# Altium schematic sheet P14 Hi3531AV100(SATA&PC.SchDoc
size 420 x 297 mm
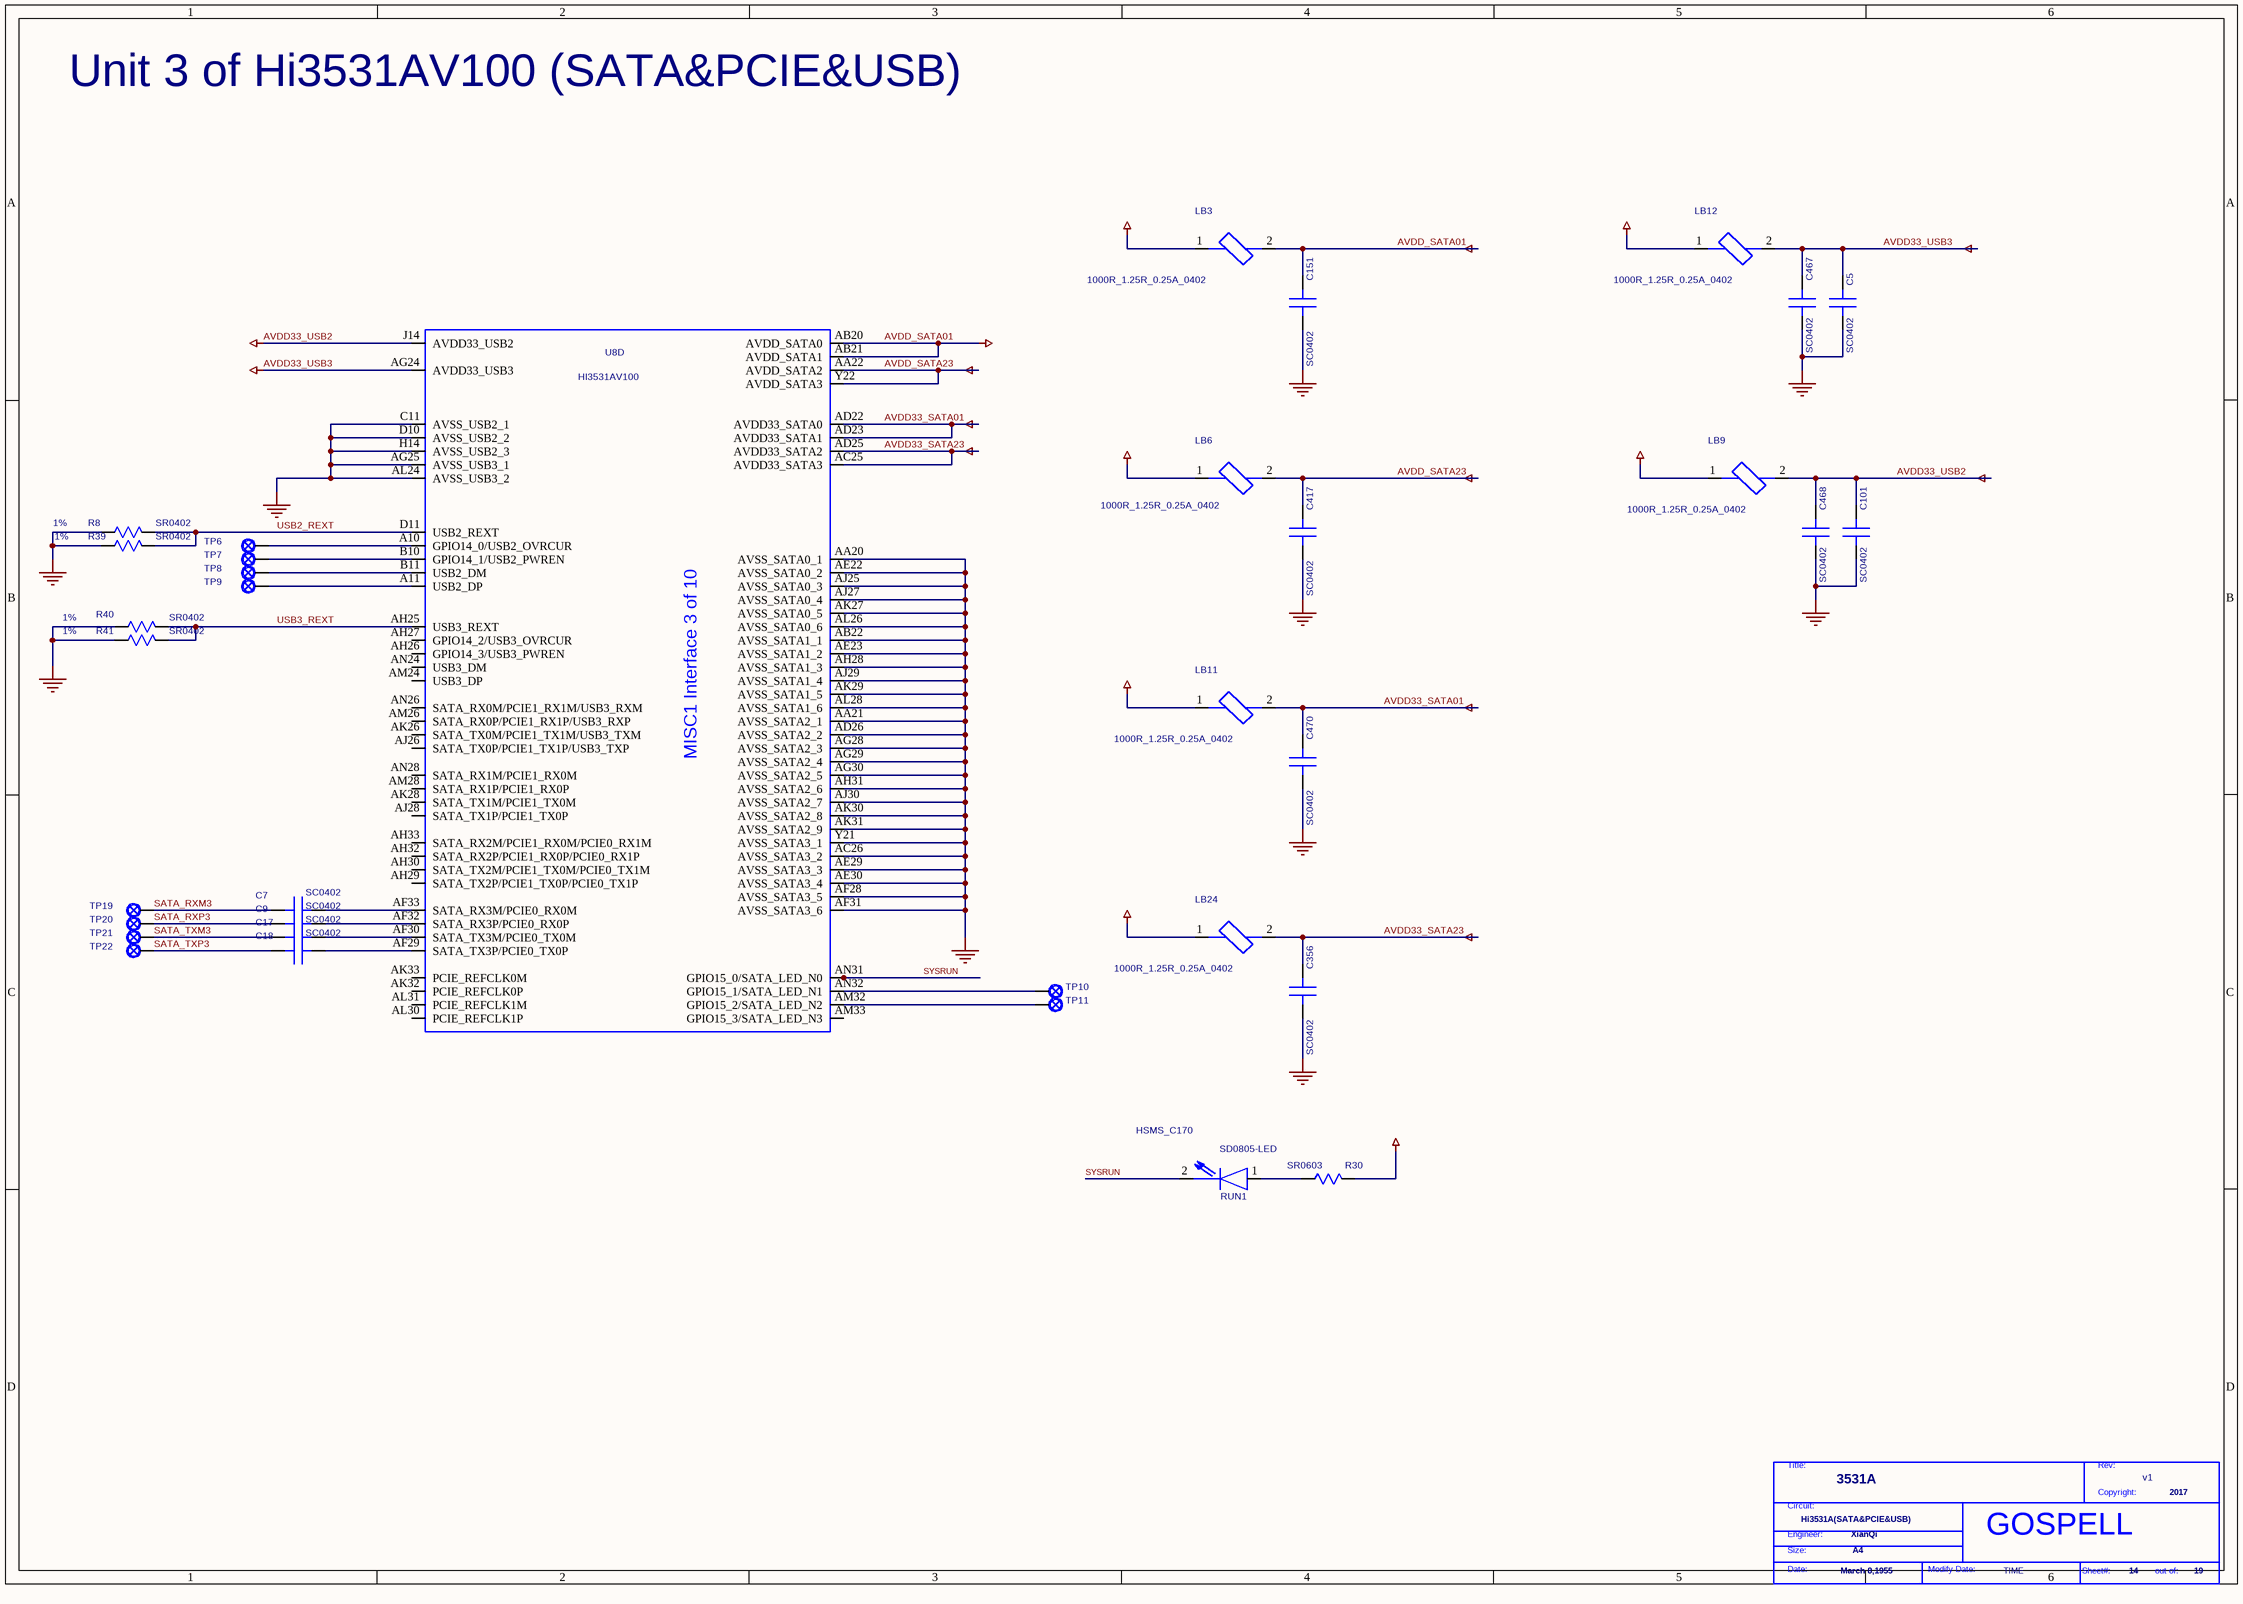
[diagram p0: P14 Hi3531AV100(SATA&PC.SchDoc]

## Parts
*  Page Modify Date: TIME  Engineer: XianQi  Copyright: 2017  Title: 3531A  RevCode: v1  Page Size: A4  Page Create Date: March 8,1955  Page Number: 14  Page Count: 19  Doc: Hi3531A(SATA&PCIE&USB)  (hidden comment: GOSPELL)  (graphical)
C5  SC0402  [SC0402]
C7  SC0402  [SC0402]
C9  SC0402  [SC0402]
C17  SC0402  [SC0402]
C18  SC0402  [SC0402]
C101  SC0402  [SC0402]
C151  SC0402  [SC0402]
C356  SC0402  [SC0402]
C417  SC0402  [SC0402]
C467  SC0402  [SC0402]
C468  SC0402  [SC0402]
C470  SC0402  [SC0402]
LB3  SL0402  [SL0402]  (value not drawn)
LB6  SL0402  [SL0402]  (value not drawn)
LB9  SL0402  [SL0402]  (value not drawn)
LB11  SL0402  [SL0402]  (value not drawn)
LB12  SL0402  [SL0402]  (value not drawn)
LB24  SL0402  [SL0402]  (value not drawn)
R8  SR0402  [SR0402]
R30  SR0603  [SR0603]
R39  SR0402  [SR0402]
R40  SR0402  [SR0402]
R41  SR0402  [SR0402]
RUN1  SD0805-LED  DEVICE: HSMS_C170  [SD0805-LED]
TP6  TP24-SMD  [TP24-SMD]  (value not drawn)
TP7  TP24-SMD  [TP24-SMD]  (value not drawn)
TP8  TP24-SMD  [TP24-SMD]  (value not drawn)
TP9  TP24-SMD  [TP24-SMD]  (value not drawn)
TP10  TP24-SMD  [TP24-SMD]  (value not drawn)
TP11  TP24-SMD  [TP24-SMD]  (value not drawn)
TP19  TP24-SMD  [TP24-SMD]  (value not drawn)
TP20  TP24-SMD  [TP24-SMD]  (value not drawn)
TP21  TP24-SMD  [TP24-SMD]  (value not drawn)
TP22  TP24-SMD  [TP24-SMD]  (value not drawn)
U8  DEVICE: HI3531AV100  [BGA805-32-3333]  (hidden comment: BGA805-32-3333)  (part D of 10)

## Nets
3V3: LB9.1 LB11.1 LB12.1 LB24.1 R30.1(A)
AVDD33_SATA01: C470.1(A) LB11.2 U8.AD22(AVDD33_SATA0) U8.AD23(AVDD33_SATA1)
AVDD33_SATA23: C356.1(A) LB24.2 U8.AC25(AVDD33_SATA3) U8.AD25(AVDD33_SATA2)
AVDD33_USB2: C101.1(A) C468.1(A) LB9.2 U8.J14(AVDD33_USB2)
AVDD33_USB3: C5.1(A) C467.1(A) LB12.2 U8.AG24(AVDD33_USB3)
AVDD_SATA01: C151.1(A) LB3.2 U8.AB20(AVDD_SATA0) U8.AB21(AVDD_SATA1)
AVDD_SATA23: C417.1(A) LB6.2 U8.AA22(AVDD_SATA2) U8.Y22(AVDD_SATA3)
DVDD_CORE: LB3.1 LB6.1
GND: C5.2(B) C101.2(B) C151.2(B) C356.2(B) C417.2(B) C467.2(B) C468.2(B) C470.2(B) R8.1(A) R39.1(A) R40.1(A) R41.1(A) U8.AA20(AVSS_SATA0_1) U8.AA21(AVSS_SATA2_1) U8.AB22(AVSS_SATA1_1) U8.AC26(AVSS_SATA3_2) U8.AD26(AVSS_SATA2_2) U8.AE22(AVSS_SATA0_2) U8.AE23(AVSS_SATA1_2) U8.AE29(AVSS_SATA3_3) U8.AE30(AVSS_SATA3_4) U8.AF28(AVSS_SATA3_5) U8.AF31(AVSS_SATA3_6) U8.AG25(AVSS_USB3_1) U8.AG28(AVSS_SATA2_3) U8.AG29(AVSS_SATA2_4) U8.AG30(AVSS_SATA2_5) U8.AH28(AVSS_SATA1_3) U8.AH31(AVSS_SATA2_6) U8.AJ25(AVSS_SATA0_3) U8.AJ27(AVSS_SATA0_4) U8.AJ29(AVSS_SATA1_4) U8.AJ30(AVSS_SATA2_7) U8.AK27(AVSS_SATA0_5) U8.AK29(AVSS_SATA1_5) U8.AK30(AVSS_SATA2_8) U8.AK31(AVSS_SATA2_9) U8.AL24(AVSS_USB3_2) U8.AL26(AVSS_SATA0_6) U8.AL28(AVSS_SATA1_6) U8.C11(AVSS_USB2_1) U8.D10(AVSS_USB2_2) U8.H14(AVSS_USB2_3) U8.Y21(AVSS_SATA3_1)
SATA_RXM3: C7.1(A) TP19.1
SATA_RXP3: C9.1(A) TP20.1
SATA_TXM3: C17.1(A) TP21.1
SATA_TXP3: C18.1(A) TP22.1
SYSRUN: RUN1.2(B) U8.AN31(GPIO15_0/SATA_LED_N0)
USB2_REXT: R8.2(B) R39.2(B) U8.D11(USB2_REXT)
USB3_REXT: R40.2(B) R41.2(B) U8.AH25(USB3_REXT)
NetC7_2: C7.2(B) U8.AF33(SATA_RX3M/PCIE0_RX0M)
NetC9_2: C9.2(B) U8.AF32(SATA_RX3P/PCIE0_RX0P)
NetC17_2: C17.2(B) U8.AF30(SATA_TX3M/PCIE0_TX0M)
NetC18_2: C18.2(B) U8.AF29(SATA_TX3P/PCIE0_TX0P)
NetR30_2: R30.2(B) RUN1.1(A)
NetTP6_1: TP6.1 U8.A10(GPIO14_0/USB2_OVRCUR)
NetTP7_1: TP7.1 U8.B10(GPIO14_1/USB2_PWREN)
NetTP8_1: TP8.1 U8.B11(USB2_DM)
NetTP9_1: TP9.1 U8.A11(USB2_DP)
NetTP10_1: TP10.1 U8.AN32(GPIO15_1/SATA_LED_N1)
NetTP11_1: TP11.1 U8.AM32(GPIO15_2/SATA_LED_N2)

Not connected (* = marked no-connect by the designer): U8 AH26(GPIO14_3/USB3_PWREN) AH27(GPIO14_2/USB3_OVRCUR) AH29(SATA_TX2P/PCIE1_TX0P/PCIE0_TX1P) AH30(SATA_TX2M/PCIE1_TX0M/PCIE0_TX1M) AH32(SATA_RX2P/PCIE1_RX0P/PCIE0_RX1P) AH33(SATA_RX2M/PCIE1_RX0M/PCIE0_RX1M) AJ26(SATA_TX0P/PCIE1_TX1P/USB3_TXP) AJ28(SATA_TX1P/PCIE1_TX0P) AK26(SATA_TX0M/PCIE1_TX1M/USB3_TXM) AK28(SATA_TX1M/PCIE1_TX0M) AK32(PCIE_REFCLK0P) AK33(PCIE_REFCLK0M) AL30(PCIE_REFCLK1P) AL31(PCIE_REFCLK1M) AM24(USB3_DP) AM26(SATA_RX0P/PCIE1_RX1P/USB3_RXP) AM28(SATA_RX1P/PCIE1_RX0P) AM33(GPIO15_3/SATA_LED_N3) AN24(USB3_DM) AN26(SATA_RX0M/PCIE1_RX1M/USB3_RXM) AN28(SATA_RX1M/PCIE1_RX0M)

## Notes on the sheet
- Unit 3 of Hi3531AV100 (SATA&PCIE&USB)
- (near LB3) 1000R_1.25R_0.25A_0402
- (near LB12) 1000R_1.25R_0.25A_0402
- 1%
- (near LB6) 1000R_1.25R_0.25A_0402
- (near LB9) 1000R_1.25R_0.25A_0402
- (near LB11) 1000R_1.25R_0.25A_0402
- (near LB24) 1000R_1.25R_0.25A_0402
- (in symbol GOSPELL) Title:; Rev:; Copyright:; Circuit:; Engineer:; Size:; Date:; Modify Date:; Sheet#:; out of:
- (in symbol HI3531AV100_M2_17, part D) MISC1 Interface 3 of 10

## Library data of the parts
C5 C7 C9 C17 C18 C101 = C_0_Dup2: PARTS: 1; PINSWAP: (A,B); LEVEL: STD; DEVICE: RMEMK105BJ104KV_FR; OriginalSymbolOrigin: (0,30); CODE: 8070614; %195%%232%%202%%246%: SMD陶瓷电容-16V-100NF-+/-10%-X7R-0402-BT; %182%%238%%182%%168%%185%%164%%215%%247%%181%%231%%209%%185%(V): 16; COMPONENT_HIGH_MAX: 0.55MM; %208%%161%%192%%224%%195%%251%%179%%198%: SMD陶瓷电容; PKG_TYPE: SC0402
C151 C467 C468 C470 = C_0_Dup2: PARTS: 1; PINSWAP: (A,B); LEVEL: STD; DEVICE: CV05X5R105K10AH; OriginalSymbolOrigin: (0,30); CODE: 8070612; %195%%232%%202%%246%: SMD陶瓷电容-10V-1000NF-+/-10%-X5R-0402-BT,TS16949; %182%%238%%182%%168%%185%%164%%215%%247%%181%%231%%209%%185%(V): 10; COMPONENT_HIGH_MAX: 0.55MM; %208%%161%%192%%224%%195%%251%%179%%198%: SMD陶瓷电容; PKG_TYPE: SC0402
C356 C417 = C_0_Dup2: PARTS: 1; PINSWAP: (A,B); LEVEL: STD; DEVICE: CV05X5R105K10AH; OriginalSymbolOrigin: (0,30); %208%%161%%192%%224%%195%%251%%179%%198%: SMD陶瓷电容; COMPONENT_HIGH_MAX: 0.55MM; %182%%238%%182%%168%%185%%164%%215%%247%%181%%231%%209%%185%(V): 10; %195%%232%%202%%246%: SMD陶瓷电容-10V-1000NF-+/-10%-X5R-0402-BT,TS16949; CODE: 8070612; PKG_TYPE: SC0402
LB3 LB11 LB12 = LB_0: PARTS: 1; DEVICE: BLM15HG102SN1D; LEVEL: STD; OriginalSymbolOrigin: (20,50); %208%%161%%192%%224%%195%%251%%179%%198%: EMI磁珠; COMPONENT_HIGH_MAX: 0.55MM; %195%%232%%202%%246%: EMI磁珠-+/-25%-1000OHM-1.25OHM-0.25A-0402-1400OHM@1GHZ-1400OHM@1GHZ; CODE: 10070019; PKG_TYPE: SL0402
LB6 LB9 LB24 = LB_0: PARTS: 1; DEVICE: BLM15HG102SN1D; LEVEL: STD; OriginalSymbolOrigin: (20,50); CODE: 10070019; %195%%232%%202%%246%: EMI磁珠-+/-25%-1000OHM-1.25OHM-0.25A-0402-1400OHM@1GHZ-1400OHM@1GHZ; COMPONENT_HIGH_MAX: 0.55MM; %208%%161%%192%%224%%195%%251%%179%%198%: EMI磁珠; PKG_TYPE: SL0402
R8 R40 R41 = R_1: PARTS: 1; LEVEL: STD; DEVICE: RC0402FR_07270RL; PINSWAP: (A,B); OriginalSymbolOrigin: (10,20); CODE: 7092035; %195%%232%%202%%246%: 片式厚膜电阻器-0.0625W-270OHM-+/-1%-1.0*0.5*0.35 MM; %182%%238%%182%%168%%185%%166%%194%%202%(W): 0.06; %215%%232%%214%%181%%212%%202%%208%%237%%198%%171%%178%%238%: +/-1%; COMPONENT_HIGH_MAX: 0.4MM; %208%%161%%192%%224%%195%%251%%179%%198%: 片式厚膜电阻器; PKG_TYPE: SR0402
R30 = R_1: PARTS: 1; LEVEL: STD; DEVICE: RC0603FR_07499R; PINSWAP: (A,B); OriginalSymbolOrigin: (10,20); CODE: 7090676; %195%%232%%202%%246%: 片式厚膜电阻器-0.1W-499OHM-+/-1%-0603; %182%%238%%182%%168%%185%%166%%194%%202%(W): 0.1; %215%%232%%214%%181%%212%%202%%208%%237%%198%%171%%178%%238%: +/-1%; COMPONENT_HIGH_MAX: 0.55MM; %208%%161%%192%%224%%195%%251%%179%%198%: 片式厚膜电阻器; PKG_TYPE: SR0603
R39 = R_1: PARTS: 1; LEVEL: STD; DEVICE: RC0402FR_07270RL; PINSWAP: (A,B); OriginalSymbolOrigin: (10,20); %208%%161%%192%%224%%195%%251%%179%%198%: 片式厚膜电阻器; COMPONENT_HIGH_MAX: 0.4MM; %215%%232%%214%%181%%212%%202%%208%%237%%198%%171%%178%%238%: +/-1%; %182%%238%%182%%168%%185%%166%%194%%202%(W): 0.06; %195%%232%%202%%246%: 片式厚膜电阻器-0.0625W-270OHM-+/-1%-1.0*0.5*0.35 MM; CODE: 7092035; PKG_TYPE: SR0402
RUN1 = LED_1: PARTS: 1; LEVEL: STD; CODE: 15020062; OriginalSymbolOrigin: (10,20); %208%%161%%192%%224%%195%%251%%179%%198%: 发光二极管; COMPONENT_HIGH_MAX: 1.1MM; %195%%232%%202%%246%: 发光二极管-0.015CD-红色/630NM-15MA-0805; PKG_TYPE: SD0805-LED
TP6-TP11 TP19-TP22 = TESTPOINT_0: PARTS: 1; DEVICE: TEST-SMD; LEVEL: STD; OriginalSymbolOrigin: (20,20); PKG_TYPE: TP24-SMD
U8 = HI3531AV100_M2_17: FORWARD_PCB: 1; HETERO: (HI3531AV100_DDR1),(HI3531AV100_DDR2),(HI3531AV100_SYSTEM),(HI3531AV100_AD),(HI3531AV100_VO),(HI3531AV100_M1),(HI3531AV100_M2),(HI3531AV100_POWER),(HI3531AV100_VSS1),(HI3531AV100_VSS2); LEVEL: STD; OriginalSymbolOrigin: (30,630); CODE: 35020607; CaptureCellPackProp: HI3531AV100_M2D; PARTS: 1; PKG_TYPE: BGA805-32-3333